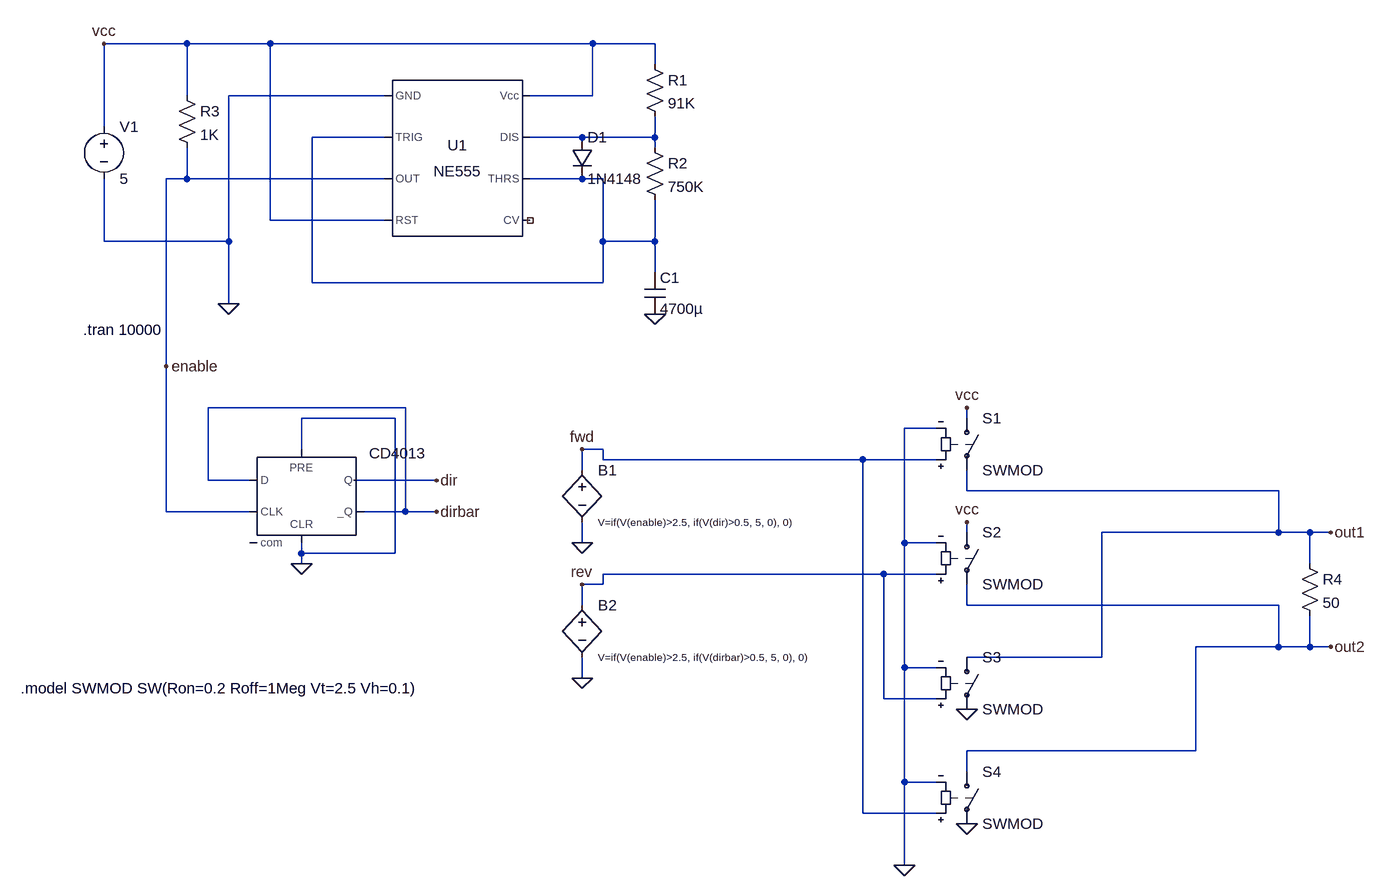
[diagram p0: schematic ne555_5H_40L_CD4013_Direction_HBridge_WatchWinder.asc]
ne555_5H_40L_CD4013_Direction_HBridge_WatchWinder.asc, the LTspice schematic file:
Version 4.1
SHEET 1 1752 1284
WIRE -208 0 -336 0
WIRE -80 0 -208 0
WIRE 416 0 -80 0
WIRE 512 0 416 0
WIRE 512 32 512 0
WIRE -208 80 -208 0
WIRE 96 80 -144 80
WIRE 416 80 416 0
WIRE 416 80 320 80
WIRE -336 128 -336 0
WIRE 96 144 -16 144
WIRE 400 144 320 144
WIRE 512 144 512 112
WIRE 512 144 400 144
WIRE 512 160 512 144
WIRE -208 208 -208 160
WIRE -208 208 -240 208
WIRE 96 208 -208 208
WIRE 400 208 320 208
WIRE 432 208 400 208
WIRE -80 272 -80 0
WIRE 96 272 -80 272
WIRE -336 304 -336 208
WIRE -144 304 -144 80
WIRE -144 304 -336 304
WIRE 432 304 432 208
WIRE 512 304 512 240
WIRE 512 304 432 304
WIRE 512 352 512 304
WIRE -16 368 -16 144
WIRE 432 368 432 304
WIRE 432 368 -16 368
WIRE -144 400 -144 304
WIRE -240 496 -240 208
WIRE 128 560 -176 560
WIRE 112 576 -32 576
WIRE 992 576 992 560
WIRE 944 592 896 592
WIRE -32 624 -32 576
WIRE 432 624 400 624
WIRE 432 640 432 624
WIRE 832 640 432 640
WIRE 944 640 832 640
WIRE 400 656 400 624
WIRE -176 672 -176 560
WIRE -112 672 -176 672
WIRE 176 672 48 672
WIRE 992 688 992 656
WIRE 1472 688 992 688
WIRE -240 720 -240 496
WIRE -112 720 -240 720
WIRE 128 720 128 560
WIRE 128 720 64 720
WIRE 176 720 128 720
WIRE 992 752 992 736
WIRE 1472 752 1472 688
WIRE 1472 752 1200 752
WIRE 1520 752 1472 752
WIRE 1552 752 1520 752
WIRE 400 768 400 736
WIRE 896 768 896 592
WIRE 944 768 896 768
WIRE -32 784 -32 768
WIRE 112 784 112 576
WIRE 112 784 -32 784
WIRE -32 800 -32 784
WIRE 1520 800 1520 752
WIRE 864 816 432 816
WIRE 944 816 864 816
WIRE 432 832 432 816
WIRE 432 832 400 832
WIRE 400 864 400 832
WIRE 992 864 992 832
WIRE 1472 864 992 864
WIRE 1472 928 1472 864
WIRE 1472 928 1344 928
WIRE 1520 928 1520 880
WIRE 1520 928 1472 928
WIRE 1552 928 1520 928
WIRE 1200 944 1200 752
WIRE 1200 944 992 944
WIRE 896 960 896 768
WIRE 944 960 896 960
WIRE 400 976 400 944
WIRE 864 1008 864 816
WIRE 944 1008 864 1008
WIRE 1344 1088 1344 928
WIRE 1344 1088 992 1088
WIRE 992 1120 992 1088
WIRE 896 1136 896 960
WIRE 944 1136 896 1136
WIRE 832 1184 832 640
WIRE 944 1184 832 1184
WIRE 896 1264 896 1136
FLAG 512 416 0
FLAG -144 400 0
FLAG -32 800 0
FLAG -240 496 enable
FLAG 176 672 dir
FLAG 176 720 dirbar
FLAG 400 624 fwd
FLAG 400 768 0
FLAG 400 976 0
FLAG 400 832 rev
FLAG 896 1264 0
FLAG 1552 752 out1
FLAG 1552 928 out2
FLAG 992 1200 0
FLAG 992 1024 0
FLAG 992 560 vcc
FLAG 992 736 vcc
FLAG -336 0 vcc
SYMBOL Misc\\NE555 208 176 R0
SYMATTR InstName U1
SYMBOL voltage -336 112 R0
SYMATTR InstName V1
SYMATTR Value 5
SYMBOL res 496 16 R0
SYMATTR InstName R1
SYMATTR Value 91K
SYMBOL res 496 144 R0
SYMATTR InstName R2
SYMATTR Value 750K
SYMBOL res -224 64 R0
SYMATTR InstName R3
SYMATTR Value 1K
SYMBOL cap 496 352 R0
SYMATTR InstName C1
SYMATTR Value 4700µ
SYMBOL diode 384 144 R0
SYMATTR InstName D1
SYMATTR Value 1N4148
SYMBOL Digital\\dflop -32 624 R0
SYMATTR InstName CD4013
SYMBOL bv 400 640 R0
WINDOW 3 24 96 Left 1
SYMATTR InstName B1
SYMATTR Value V=if(V(enable)>2.5, if(V(dir)>0.5, 5, 0), 0)
SYMBOL bv 400 848 R0
WINDOW 3 24 96 Left 1
SYMATTR InstName B2
SYMATTR Value V=if(V(enable)>2.5, if(V(dirbar)>0.5, 5, 0), 0)
SYMBOL sw 992 560 R0
SYMATTR InstName S1
SYMATTR Value SWMOD
SYMBOL sw 992 736 R0
SYMATTR InstName S2
SYMATTR Value SWMOD
SYMBOL sw 992 928 R0
SYMATTR InstName S3
SYMATTR Value SWMOD
SYMBOL sw 992 1104 R0
SYMATTR InstName S4
SYMATTR Value SWMOD
SYMBOL res 1504 784 R0
SYMATTR InstName R4
SYMATTR Value 50
TEXT -368 440 Left 2 !.tran 10000
TEXT -464 992 Left 2 !.model SWMOD SW(Ron=0.2 Roff=1Meg Vt=2.5 Vh=0.1)

The netlist it stands for:
* ne555_5H_40L_CD4013_Direction_HBridge_WatchWinder.asc
X§U1 0 N001 enable vcc NC_01 N001 N002 vcc NE555  ; pins GND TRIG OUT RST CV THRS DIS Vcc
V1 vcc 0 5
R1 vcc N002 91K
R2 N002 N001 750K
R3 vcc enable 1K
C1 N001 0 4700µ
D1 N002 N001 1N4148
A§CD4013 dirbar 0 enable 0 0 dirbar dir 0 DFLOP
B1 fwd 0 V=if(V(enable)>2.5, if(V(dir)>0.5, 5, 0), 0)
B2 rev 0 V=if(V(enable)>2.5, if(V(dirbar)>0.5, 5, 0), 0)
S1 vcc out1 fwd 0 SWMOD
S2 vcc out2 rev 0 SWMOD
S3 out1 0 rev 0 SWMOD
S4 out2 0 fwd 0 SWMOD
R4 out1 out2 50
.model D D
.lib standard.dio
.tran 10000
.model SWMOD SW(Ron=0.2 Roff=1Meg Vt=2.5 Vh=0.1)
.lib NE555.sub
.backanno
.end

* Results of the author's LTspice run, read from the files saved beside the schematic
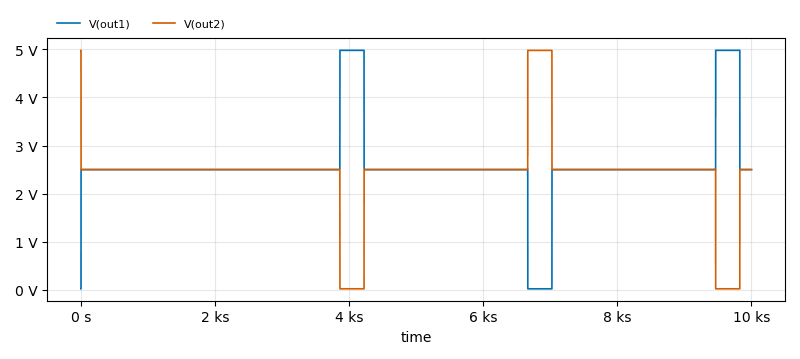
[diagram p1: Transient Analysis of ne555_5H_40L_CD4013_Direction_HBridge_WatchWinder.asc, plotted from the saved traces]
* Transient Analysis, 1 run:
*   V(out1): min 19.84 mV, max 4.98 V, average 2.59 V, rms 2.714 V, last 2.5 V
*   V(out2): min 19.84 mV, max 4.98 V, average 2.41 V, rms 2.543 V, last 2.5 V